# EasyEDA schematic 1-Schematic_EspRosNodeCAN.json
TITLE: Sheet_1; REV: 1.0; Date: 2020-07-13; Sheet: 1/1; Drawn By: fitimhalimi; Company: Your Company
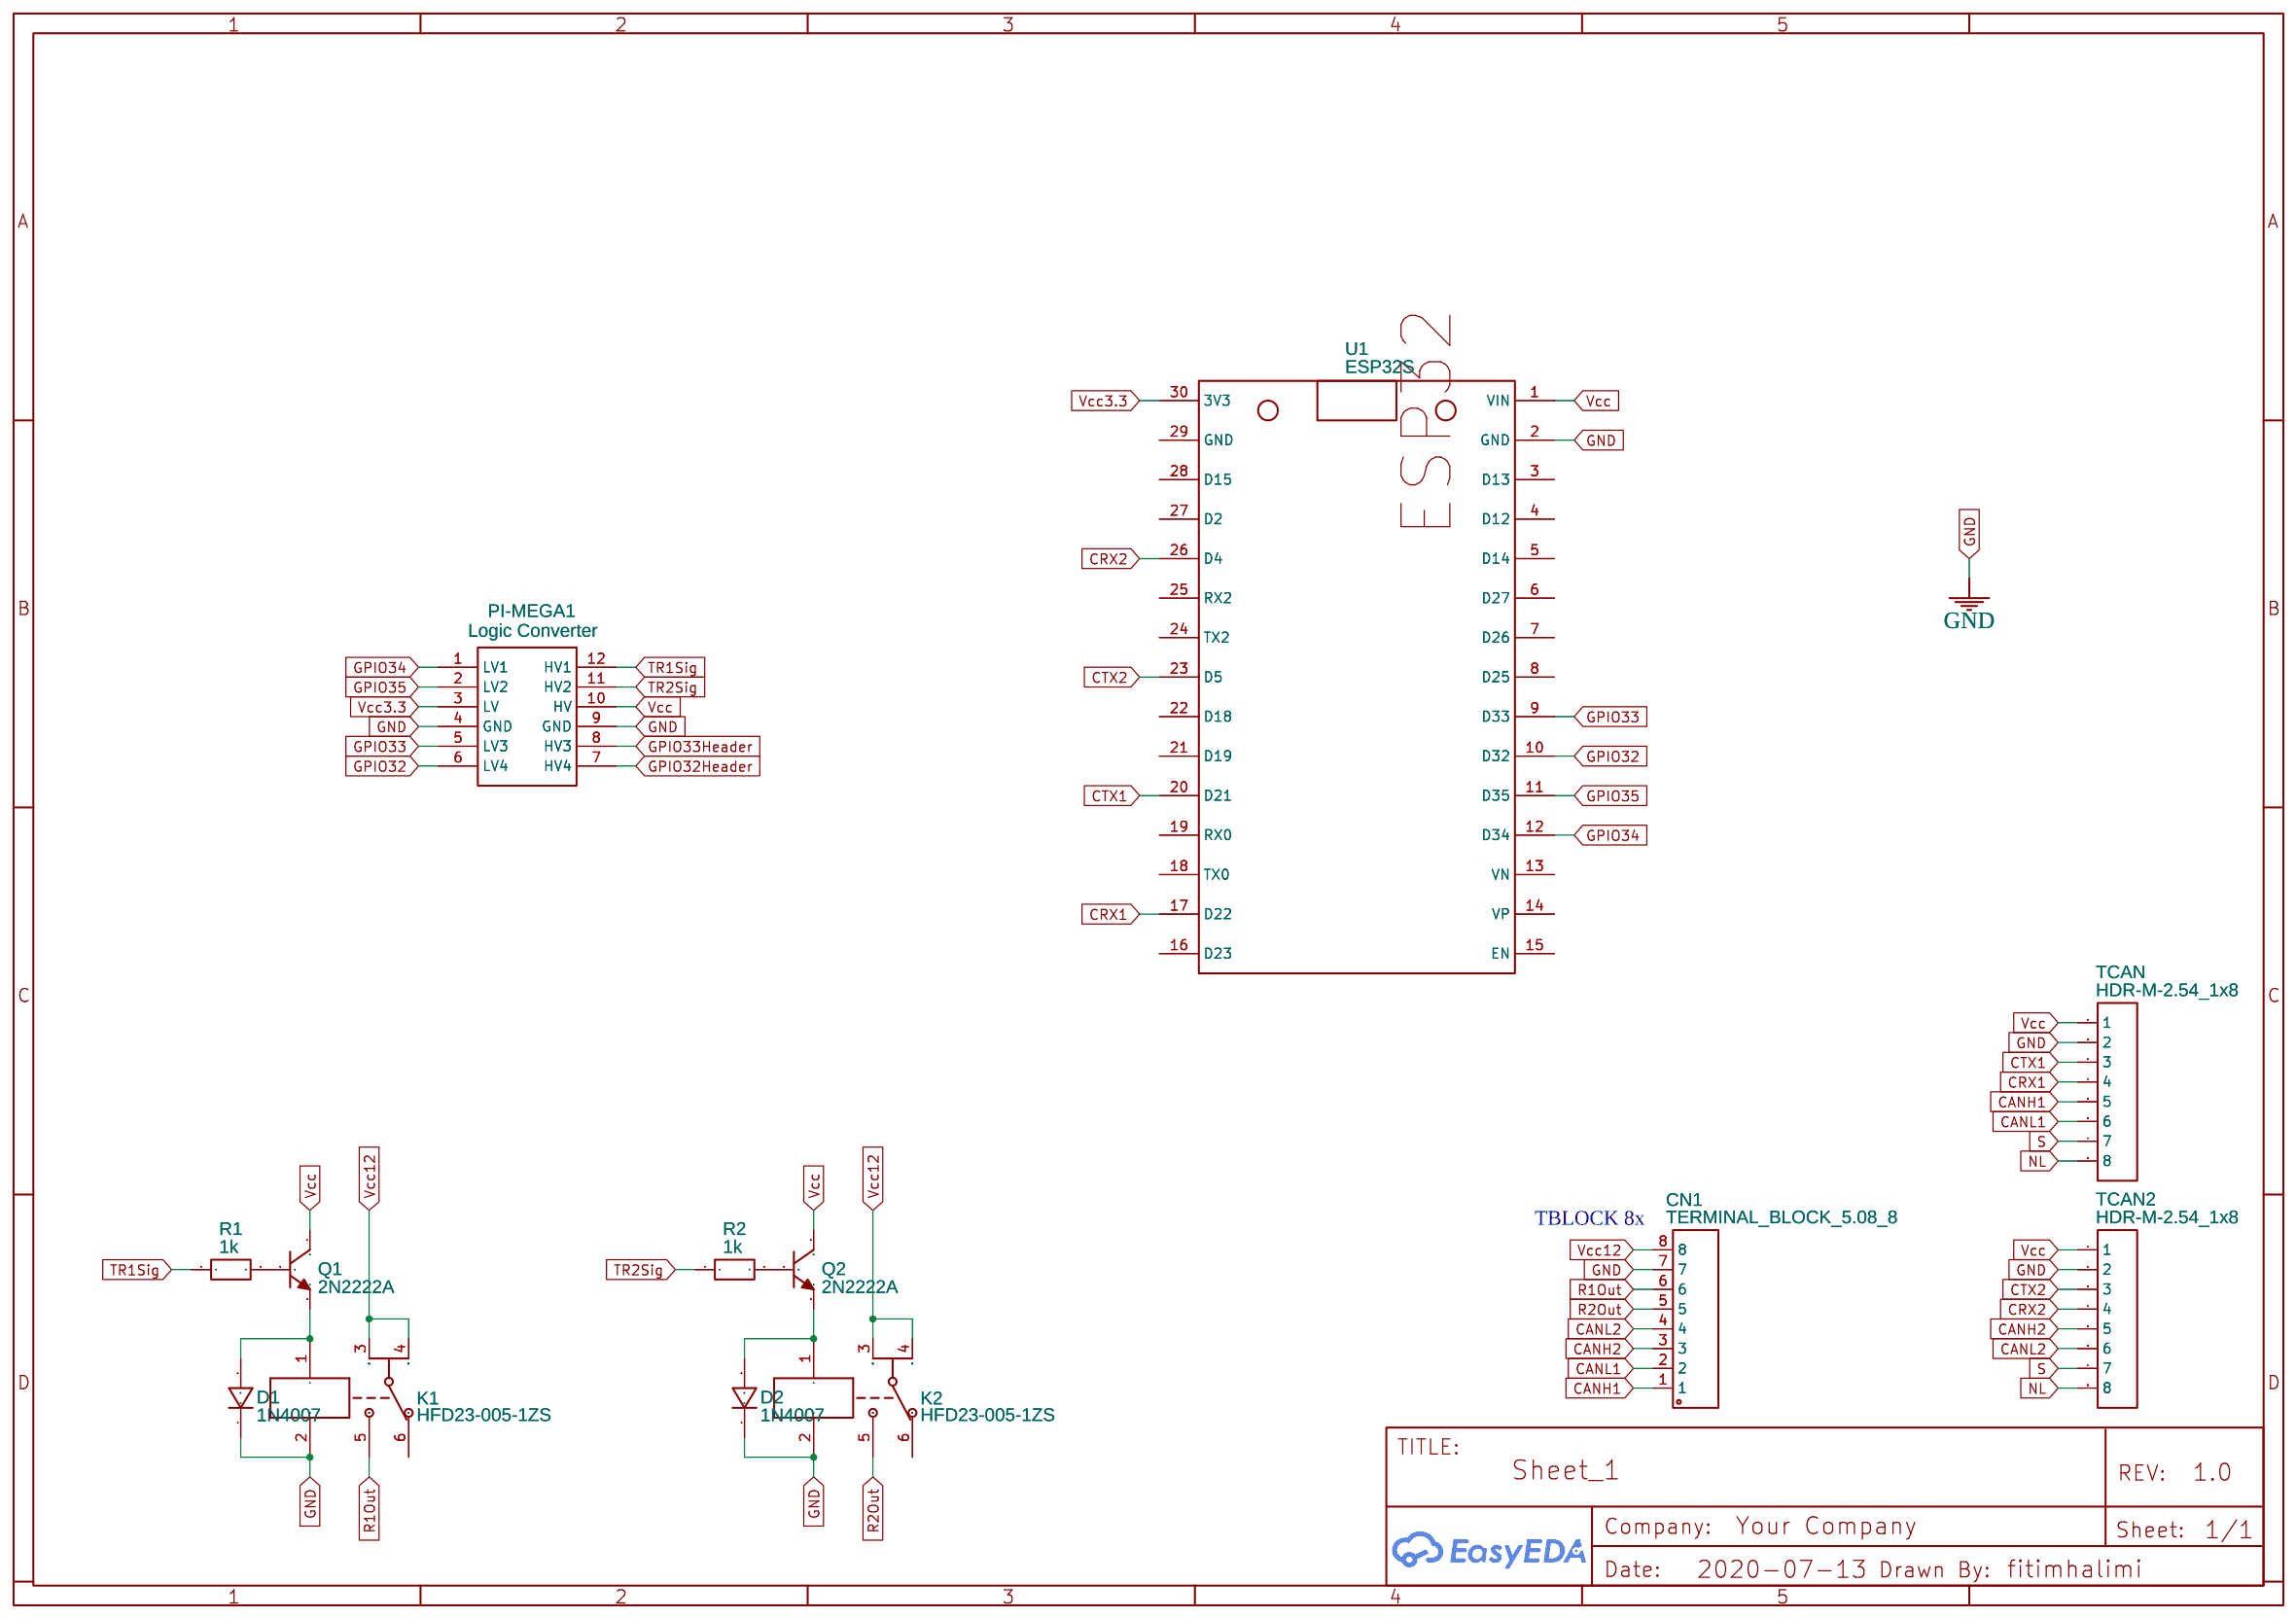
[diagram p0: schematic sheet]

## Parts
CN1  TERMINAL_BLOCK_5.08_8  [TERMINAL_BLOCK_5.08_8]
D1  1N4007  [DO-41_BD2.4-L4.7-P8.70-D0.9-RD]
D2  1N4007  [DO-41_BD2.4-L4.7-P8.70-D0.9-RD]
K1  HFD23-005-1ZS  [RELAY-HF_16]
K2  HFD23-005-1ZS  [RELAY-HF_16]
PI-MEGA1  Logic Converter  [LOGIC_LEVEL_CONVERTER_BI_DIRECT_4_CH]
Q1  2N2222A  [TO-92-3_L4.8-W3.7-P2.54-R]
Q2  2N2222A  [TO-92-3_L4.8-W3.7-P2.54-R]
R1  1k  [R_AXIAL-0.4]
R2  1k  [R_AXIAL-0.4]
TCAN  HDR-M-2.54_1x8  [HDR-M-2.54_1X8]
TCAN2  HDR-M-2.54_1x8  [HDR-M-2.54_1X8]
U1  ESP32S  [ESP32]

## Library data of the parts
CN1 = TERMINAL_BLOCK_5.08_8: Contributor: Leandro Blauth
D1 D2 = 1N4007: Supplier: LCSC; Manufacturer: SEMTECH; Supplier Part: C106903; Contributor: LCEDA_Lib
K1 K2 = HFD23-005-1ZS: Supplier: LCSC; Manufacturer: HF; image: //image.lceda.cn/szlcsc/C64002.jpg; Supplier Part: C64002
PI-MEGA1 = 4 Way Bi-Directional Logic Level Converter: Manufacturer Part: New SchematicLib; Contributor: Jonathan Symon (YOTTAZOID)
Q1 Q2 = 2N2222A: Supplier: LCSC; Supplier Part: C358533; Manufacturer: Foshan Blue Rocket Elec; Contributor: LCSC
R1 R2 = R_AXIAL-0.4_EU: Contributor: LCEDA_Lib
TCAN TCAN2 = HDR-M-2.54_1x8: Supplier Part: C190820; Supplier: LCSC; Contributor: LCEDA_Lib
U1 = ESP32S: Manufacturer Part: New SchematicLib; Contributor: vincenzo.bini; Image: //myelectronicslab.com/wp-content/uploads/2017/10/esp32-pinout-node-mcu-board-.jpeg

## Nets
GND: CN1.7 D1.1 D2.1 K1.2 K2.2 PI-MEGA1.4(GND) PI-MEGA1.9(GND) TCAN.2 TCAN2.2 U1.2(GND)
Vcc: PI-MEGA1.10(HV) Q1.1(C) Q2.1(C) TCAN.1 TCAN2.1 U1.1(VIN)
Vcc3.3: PI-MEGA1.3(LV) U1.30(3V3)
Vcc12: CN1.8 K1.3(COM) K1.4(COM) K2.3(COM) K2.4(COM)
CANH1: CN1.1 TCAN.5
CANH2: CN1.3 TCAN2.5
CANL1: CN1.2 TCAN.6
CANL2: CN1.4 TCAN2.6
CRX1: TCAN.4 U1.17(D22)
CRX2: TCAN2.4 U1.26(D4)
CTX1: TCAN.3 U1.20(D21)
CTX2: TCAN2.3 U1.23(D5)
GPIO32: PI-MEGA1.6(LV4) U1.10(D32)
GPIO32Header: PI-MEGA1.7(HV4)
GPIO33: PI-MEGA1.5(LV3) U1.9(D33)
GPIO33Header: PI-MEGA1.8(HV3)
GPIO34: PI-MEGA1.1(LV1) U1.12(D34)
GPIO35: PI-MEGA1.2(LV2) U1.11(D35)
NL: TCAN.8 TCAN2.8
R1Out: CN1.6 K1.5(NO)
R2Out: CN1.5 K2.5(NO)
S: TCAN.7 TCAN2.7
TR1Sig: PI-MEGA1.12(HV1) R1.1
TR2Sig: PI-MEGA1.11(HV2) R2.1
Net-(D1-2): D1.2 K1.1 Q1.3(E)
Net-(D2-2): D2.2 K2.1 Q2.3(E)
Net-(Q1-2): Q1.2(B) R1.2
Net-(Q2-2): Q2.2(B) R2.2

Not connected (* = marked no-connect by the designer): K1 6(NC); K2 6(NC); U1 3(D13) 4(D12) 5(D14) 6(D27) 7(D26) 8(D25) 13(VN) 14(VP) 15(EN) 16(D23) 18(TX0) 19(RX0) 21(D19) 22(D18) 24(TX2) 25(RX2) 27(D2) 28(D15) 29(GND)

## Notes on the sheet
- TBLOCK 8x
